# EAGLE schematic repater_i2c (EAGLE 8.2.2)
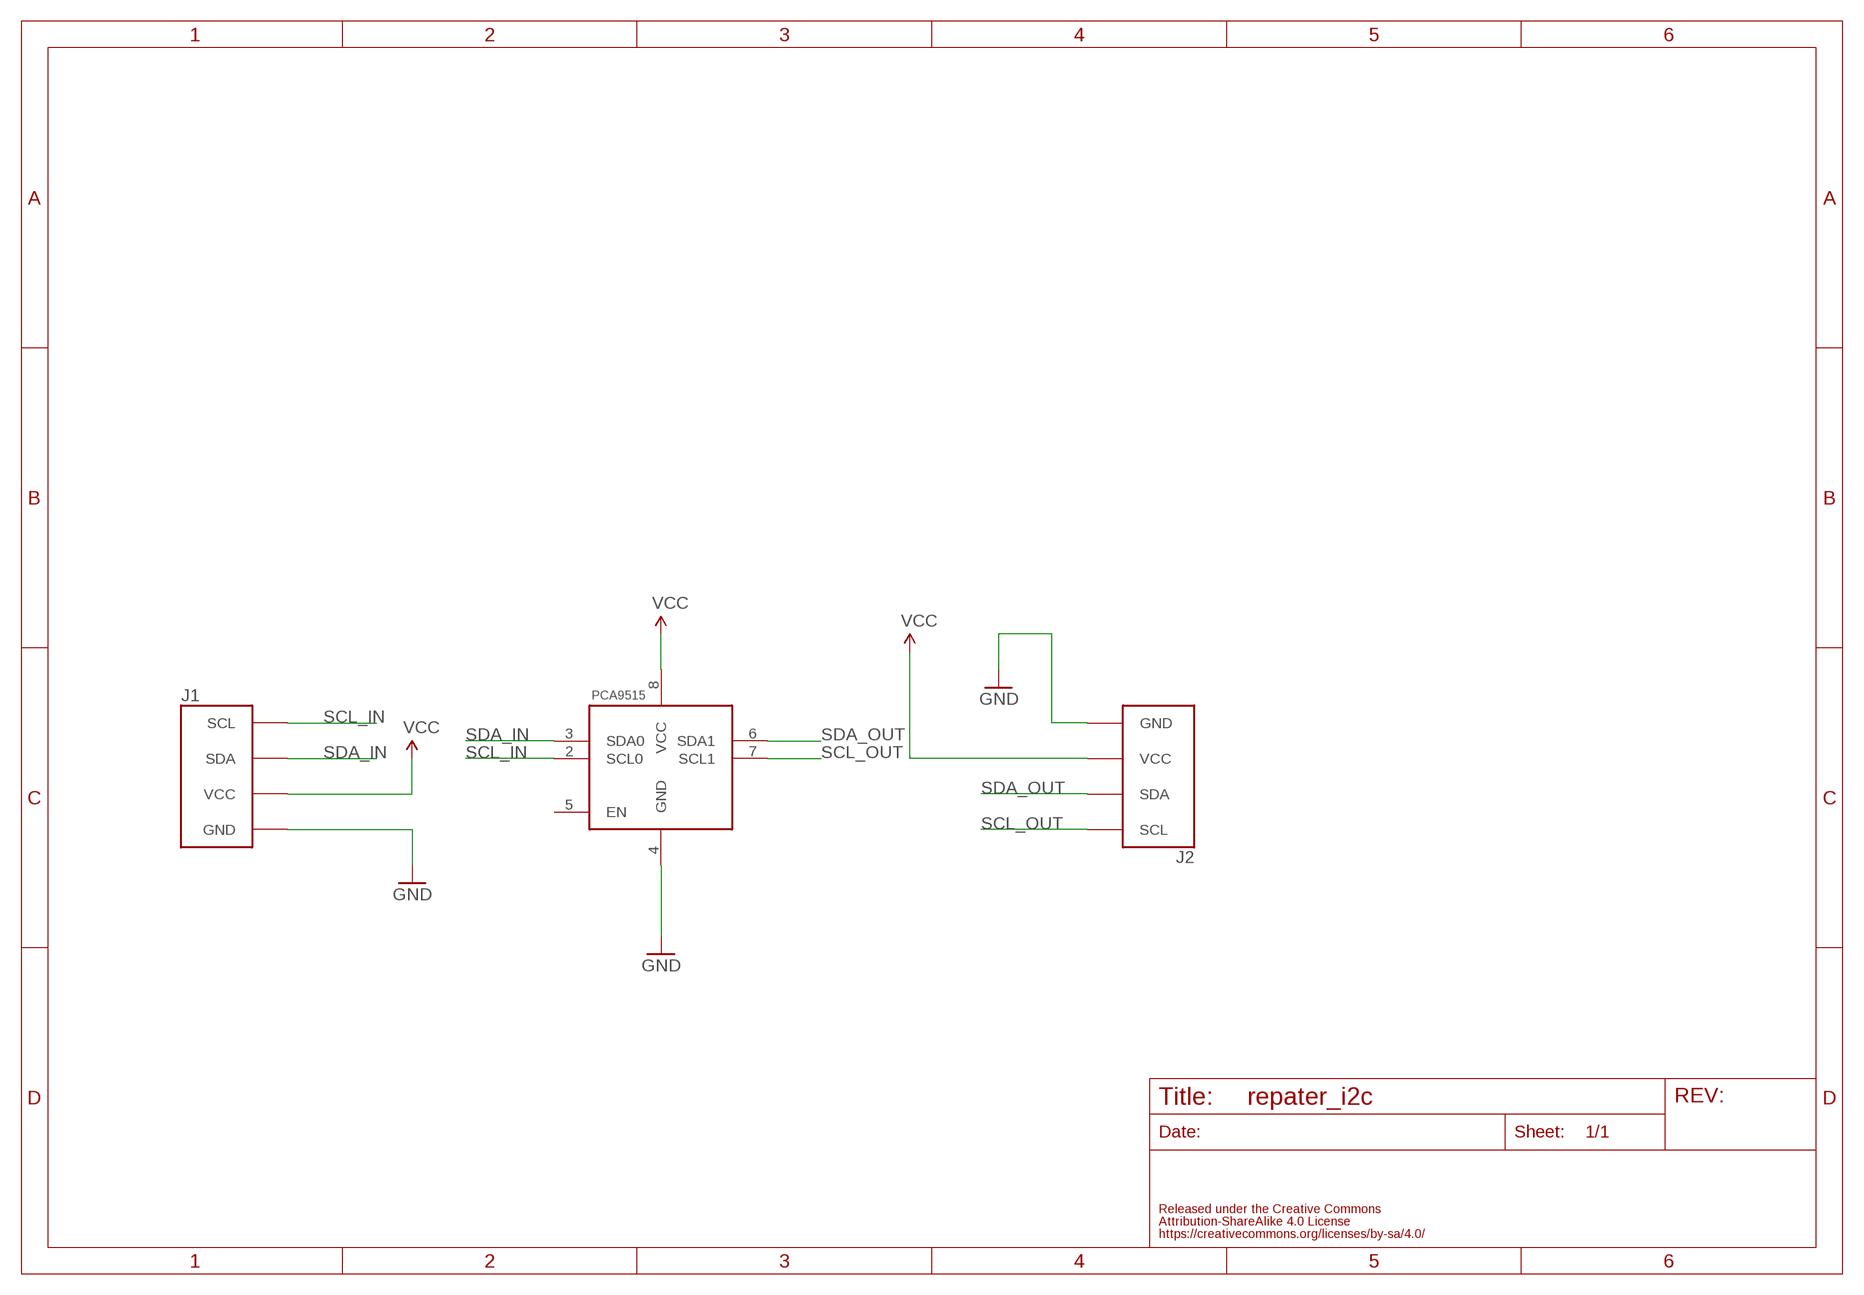
[diagram p0: schematic, sheet 1]

## Parts
J1  FABO_BRICK_I2C-S04B-PASK-2_LONG  [FABO_BRICK_I2C_S04B-PASK-2_LONG]
J2  FABO_BRICK_I2C-S04B-PASK-2_LONG  [FABO_BRICK_I2C_S04B-PASK-2_LONG]
PCA9515  PCA9515  [SO8]

## Nets
GND: J2.GND PCA9515.4(GND)
N$4: J1.GND
SCL_IN: J1.SCL PCA9515.2(SCL0)
SCL_OUT: J2.SCL PCA9515.7(SCL1)
SDA_IN: J1.SDA PCA9515.3(SDA0)
SDA_OUT: J2.SDA PCA9515.6(SDA1)
VCC: J1.VCC J2.VCC PCA9515.8(VCC)
Unconnected: PCA9515.5(EN)

## Library data of the parts
J1 J2 = FaBo-Template:FABO_BRICK_I2C: FaBo Brick I2C
PCA9515 = FaBo-Repeater:PCA9515